# Altium schematic sheet SmartSocket_v3.SchDoc
size A3; SheetNumber: 1; SheetTotal: 1
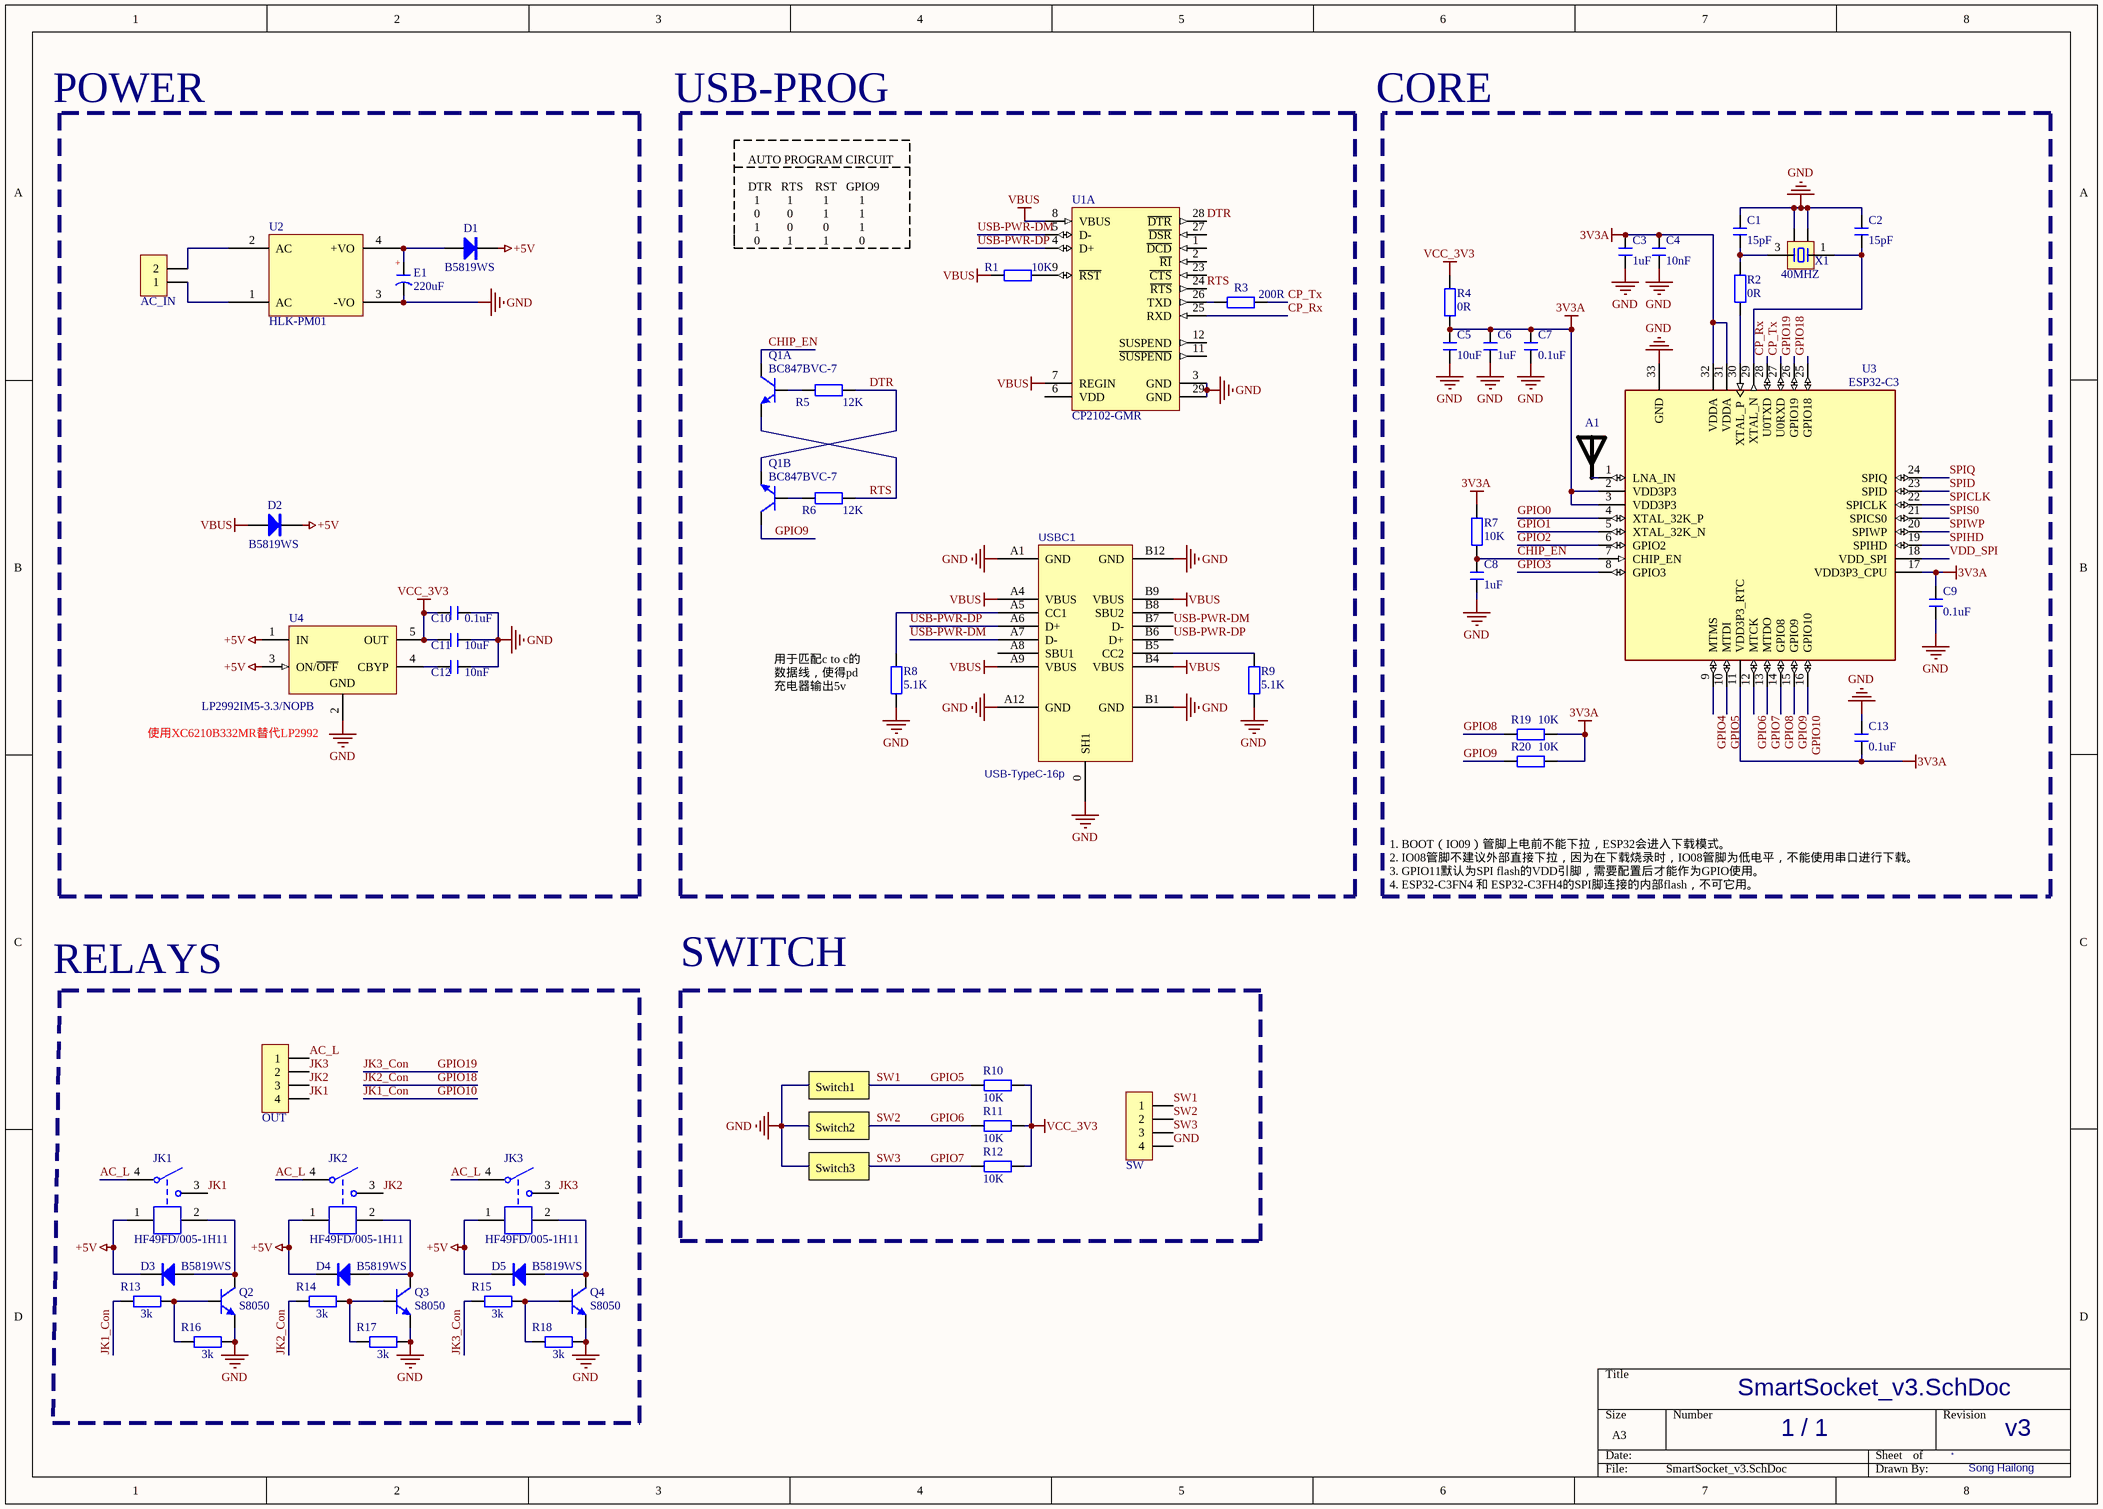
[diagram p0: SmartSocket_v3.SchDoc]

## Parts
A1  AN2051-245  [AN2051-245]  (value not drawn)
AC_IN  HDR-1X2  [KF301-5.0-2P]  (value not drawn)
C1  15pF  [C 0402_L]
C2  15pF  [C 0402_L]
C3  1uF  [C 0402_L]
C4  10nF  [C 0402_L]
C5  10uF  [C 0402_L]
C6  1uF  [C 0402_L]
C7  0.1uF  [C 0402_L]
C8  1uF  [C 0402_L]
C9  0.1uF  [C 0402_L]
C10  0.1uF  [C 0402_L]
C11  10uF  [C 0402_L]
C12  10nF  [C 0402_L]
C13  0.1uF  [C 0402_L]
D1  B5819WS  [SOD-323]
D2  B5819WS  [SOD-323]
D3  B5819WS  [SOD-323]
D4  B5819WS  [SOD-323]
D5  B5819WS  [SOD-323]
E1  220uF  [CD D(7343)]
JK1  HF49FD/005-1H11  [HF49-XX-1H11]
JK2  HF49FD/005-1H11  [HF49-XX-1H11]
JK3  HF49FD/005-1H11  [HF49-XX-1H11]
OUT  HDR-1X4  [KF301-5.0-4P]  (value not drawn)
Q1  BC847BVC-7  [SOT563-6]  (parts A,B of 2)
Q2  S8050  [SOT23-3N]
Q3  S8050  [SOT23-3N]
Q4  S8050  [SOT23-3N]
R1  10K  [R 0402_L]
R2  0R  [R 0402_L]
R3  200R  [R 0402_L]
R4  0R  [R 0402_L]
R5  12K  [R 0402_L]
R6  12K  [R 0402_L]
R7  10K  [R 0402_L]
R8  5.1K  [R 0402_L]
R9  5.1K  [R 0402_L]
R10  10K  [R 0402_L]
R11  10K  [R 0402_L]
R12  10K  [R 0402_L]
R13  3k  [R 0402_L]
R14  3k  [R 0402_L]
R15  3k  [R 0402_L]
R16  3k  [R 0402_L]
R17  3k  [R 0402_L]
R18  3k  [R 0402_L]
R19  10K  [R 0402_L]
R20  10K  [R 0402_L]
SW  HDR-1X4  [HDR2.54-LI-4P]  (value not drawn)
U1  CP2102-GMR  [SLAB-QFN-28-3125x3125TP_M]  (part A of 2)
U2  HLK-PM01  [HLK-PM01]
U3  ESP32-C3  [QFN32 5x5_M]
U4  LP2992IM5-3.3/NOPB  [DBV0005A_N]
USBC1  USB-TypeC-16p  [TYPE-C-USB-16P-1]
X1  40MHZ  [OSC 3225-4P]

## Blocks framed on the sheet
使用XC6210B332MR替代LP2992: AC_IN C10-C12 D1 D2 E1 U2 U4
RELAYS: D3-D5 JK1-JK3 OUT Q2-Q4 R13-R18
SWITCH: R10-R12 SW

## Nets
3V3A: C3.2 C4.2 C5.2 C6.2 C7.2 C9.2 C13.2 R4.1 R7.2 R19.1 R20.1 U3.2(VDD3P3) U3.3(VDD3P3) U3.11(VDD3P3_RTC) U3.17(VDD3P3_CPU) U3.31(VDDA) U3.32(VDDA)
+5V: D1.2(K) D2.2(K) D3.2(K) D4.2(K) D5.2(K) JK1.1 JK2.1 JK3.1 U4.1(IN) U4.3(ON/~{OFF})
GND: C1.2 C2.2 C3.1 C4.1 C5.1 C6.1 C7.1 C8.1 C9.1 C10.2 C11.2 C12.2 C13.1 E1.2(K) Q2.2(E) Q3.2(E) Q4.2(E) R8.1 R9.1 R16.1 R17.1 R18.1 SW.4 U1.3(GND) U1.29(GND) U2.3(-VO) U3.33(GND) U4.2(GND) USBC1.0(SH1) USBC1.A1(GND) USBC1.A12(GND) USBC1.B1(GND) USBC1.B12(GND) X1.2 X1.4
VBUS: D2.1(A) R1.1 U1.7(REGIN) U1.8(VBUS) USBC1.A4(VBUS) USBC1.A9(VBUS) USBC1.B4(VBUS) USBC1.B9(VBUS)
VCC_3V3: C10.1 C11.1 R4.2 R10.2 R11.2 R12.2 U4.5(OUT)
AC_L: JK1.4 JK2.4 JK3.4 OUT.1
CHIP_EN: C8.2 Q1.6(C1) R7.1 U3.7(CHIP_EN)
CP_Rx: U1.25(RXD) U3.28(U0TXD)
CP_Tx: R3.2 U3.27(U0RXD)
DTR: Q1.4(E2) R5.2 U1.28(~{DTR})
GPIO0: U3.4(XTAL_32K_P)
GPIO1: U3.5(XTAL_32K_N)
GPIO2: U3.6(GPIO2)
GPIO3: U3.8(GPIO3)
GPIO4: U3.9(MTMS)
GPIO5: R10.1 SW.1 U3.10(MTDI)  [also labelled SW1]
GPIO6: R11.1 SW.2 U3.12(MTCK)  [also labelled SW2]
GPIO7: R12.1 SW.3 U3.13(MTDO)  [also labelled SW3]
GPIO8: R19.2 U3.14(GPIO8)
GPIO9: Q1.3(C2) R20.2 U3.15(GPIO9)
GPIO10: R13.2 U3.16(GPIO10)  [also labelled JK1_Con]
GPIO18: R14.2 U3.25(GPIO18)  [also labelled JK2_Con]
GPIO19: R15.2 U3.26(GPIO19)  [also labelled JK3_Con]
JK1: JK1.3 OUT.4
JK2: JK2.3 OUT.3
JK3: JK3.3 OUT.2
RTS: Q1.1(E1) R6.2 U1.24(~{RTS})
SPICLK: U3.22(SPICLK)
SPID: U3.23(SPID)
SPIHD: U3.19(SPIHD)
SPIQ: U3.24(SPIQ)
SPIS0: U3.21(SPICS0)
SPIWP: U3.20(SPIWP)
USB-PWR-DM: U1.5(D-) USBC1.A7(D-) USBC1.B7(D-)
USB-PWR-DP: U1.4(D+) USBC1.A6(D+) USBC1.B6(D+)
VDD_SPI: U3.18(VDD_SPI)
NetA1_1: A1.1 U3.1(LNA_IN)
NetAC_IN_1: AC_IN.1 U2.1(AC)
NetAC_IN_2: AC_IN.2 U2.2(AC)
NetC1_1: C1.1 R2.2 X1.3
NetC2_1: C2.1 U3.29(XTAL_N) X1.1
NetC12_1: C12.1 U4.4(CBYP)
NetD1_1: D1.1(A) E1.1(A) U2.4(+VO)
NetD3_1: D3.1(A) JK1.2 Q2.3(C)
NetD4_1: D4.1(A) JK2.2 Q3.3(C)
NetD5_1: D5.1(A) JK3.2 Q4.3(C)
NetQ1_2: Q1.2(B1) R5.1
NetQ1_5: Q1.5(B2) R6.1
NetQ2_1: Q2.1(B) R13.1 R16.2
NetQ3_1: Q3.1(B) R14.1 R17.2
NetQ4_1: Q4.1(B) R15.1 R18.2
NetR1_2: R1.2 U1.9(~{RST})
NetR2_1: R2.1 U3.30(XTAL_P)
NetR3_1: R3.1 U1.26(TXD)
NetR8_2: R8.2 USBC1.A5(CC1)
NetR9_2: R9.2 USBC1.B5(CC2)

Not connected (* = marked no-connect by the designer): U1 1(~{DCD}) 2(~{RI}) 6(VDD) 11(~{SUSPEND}) 12(SUSPEND) 23(~{CTS}) 27(~{DSR}); USBC1 A8(SBU1) B8(SBU2)

## Notes on the sheet
- POWER
- USB-PROG
- CORE
- AUTO PROGRAM CIRCUIT
  DTR   RTS    RST   GPIO9
  1         1          1          1
  0         0          1          1
  1         0          0          1
  0         1          1          0
- (near R8) 用于匹配c to c的数据线，使得pd充电器输出5v
- 1. BOOT（IO09）管脚上电前不能下拉，ESP32会进入下载模式。
  2. IO08管脚不建议外部直接下拉，因为在下载烧录时，IO08管脚为低电平，不能使用串口进行下载。
  3. GPIO11默认为SPI flash的VDD引脚，需要配置后才能作为GPIO使用。
  4. ESP32-C3FN4 和 ESP32-C3FH4的SPI脚连接的内部flash，不可它用。
- Switch1
- Switch2
- Switch3
- /
- v3
- Song Hailong
- (in symbol C-CD) +

## Library data of the parts
A1 = ANT-Rainsun-AP2051: 天线AN2051-245
AC_IN = Header 02 5.0: 2P接插件; 版权归属: 源创客; BOM名称: 2P接插件; 学习资源: www.ooocke.com
C1-C13 = C: 无极性贴片电容; 版权归属: 源创客; BOM名称: 无极性贴片电容; 学习资源: www.ooocke.com
D1-D5 = 1N5819: 肖特基二极管; 版权归属: 源创客; 属性: 40V/2A; BOM名称: 肖特基二极管; 学习资源: www.ooocke.com
E1 = C-CD: 贴片钽电容; 版权归属: 源创客; BOM名称: 贴片钽电容; 学习资源: www.ooocke.com
JK1-JK3 = HF49FD/005-1H11: 5V一组常开
OUT = Header 04 5.0: 4P接插件; 版权归属: 源创客; BOM名称: 4P接插件; 学习资源: www.ooocke.com
Q2-Q4 = 8050-SMD: 高频放大-NPN型; 版权归属: 源创客; 属性: 40V 1.5A 1W 100MHZ; BOM名称: 高频放大-NPN型; 学习资源: www.ooocke.com
R1-R20 = R: 贴片电阻; 版权归属: 源创客; BOM名称: 贴片电阻; 学习资源: www.ooocke.com
SW = Header 04 2.54: 4P接插件; 版权归属: 源创客; BOM名称: 4P接插件; 学习资源: www.ooocke.com
U1 = CMP-2000-04924-1: Single-Chip USB to URAT Bridge, 3.3 V, -40 to 85 degC, 28-Pin QFN, RoHS, Tape and Reel; Manufacturer: Silicon Labs; Interface Circuit Standard 1: RS-232; Transmitter and Receiver FIFO Counter: No; Supply Current: 26mA; Operating Supply Voltage (Min): 3V; Operating Supply Voltage (Typ): 3.3V; Data Rate: 1000kbps; Operating Supply Voltage (Max): 3.6V; Number of Channels: 1; Package URL: http://www.silabs.com/Support%20Documents/TechnicalDocs/C8051T61x.pdf; Operating Temperature (Max): 85C; Datasheet URL: http://www.mouser.com/ds/2/368/CP2102-9-247052.pdf; Operating Temperature Classification: Industrial; Operating Temperature (Min): -40C; Package Description: 28-Pin Quad-Flat No-Leads Package, Body 5 x 5 mm, Pitch 0.5 mm; Manufacturer URL: http://www.silabs.com/; Rad Hardened: No; Package Reference: QFN-28; Pin Count: 28; Packaging: TapeandReel; Mounting: SurfaceMount; Package Type: QFNEP; Datasheet Version: Rev. 1.6, 12/2013
U2 = Component_1: 220V转5V模块
U3 = ESP32-C3: Bluetooth, WiFi 802.11b/g/n, Bluetooth v5.0 Transceiver Module 2.402GHz ~ 2.48GHz Antenna Not Included Surface Mount; MF: Espressif Systems; MP: ESP32-C3FH4; Check_prices: https://www.snapeda.com/parts/ESP32-C3FH4/Espressif%20Systems/view-part/5881917/?ref=eda; Availability: In Stock; Value: *; Price: None; Purchase-URL: https://pricing.snapeda.com/search/part/ESP32-C3FH4/?ref=eda; Package: VFQFN-32 Espressif Systems; SnapEDA_Link: https://www.snapeda.com/parts/ESP32-C3FH4/Espressif%20Systems/view-part/5881917/?ref=snap
U4 = CMP-0062-02175-3: Micropower 250 mA Low-Noise Ultra Low-Dropout Regulator, 5-pin SOT-23, Pb-Free; Manufacturer: Texas Instruments; CompType: LDO IC; PackageTopMarking: LFEB*XTT; PowerWise: N; PackageReference: DBV0005A; ComponentLink1Description: Datasheet URL; RoHS: Y; PackageDescription: Molded SOT-23, .115 x .063 x .040 in Body, 5 Lead, .0375 in Pitch; ComponentLink1URL: http://www.ti.com/general/docs/lit/getliterature.tsp?genericPartNumber=LP2992&fileType=pdf; PinCount: 5
X1 = XTAL-4P: 4脚无源晶振; 版权归属: 源创客; BOM名称: 4脚无源晶振; 学习资源: www.ooocke.com